# Altium project SINDiB_MM.PrjPcb (part 2 of 2)

## Sheet motor.SchDoc
size A4; SheetNumber: 4; SheetTotal: 4
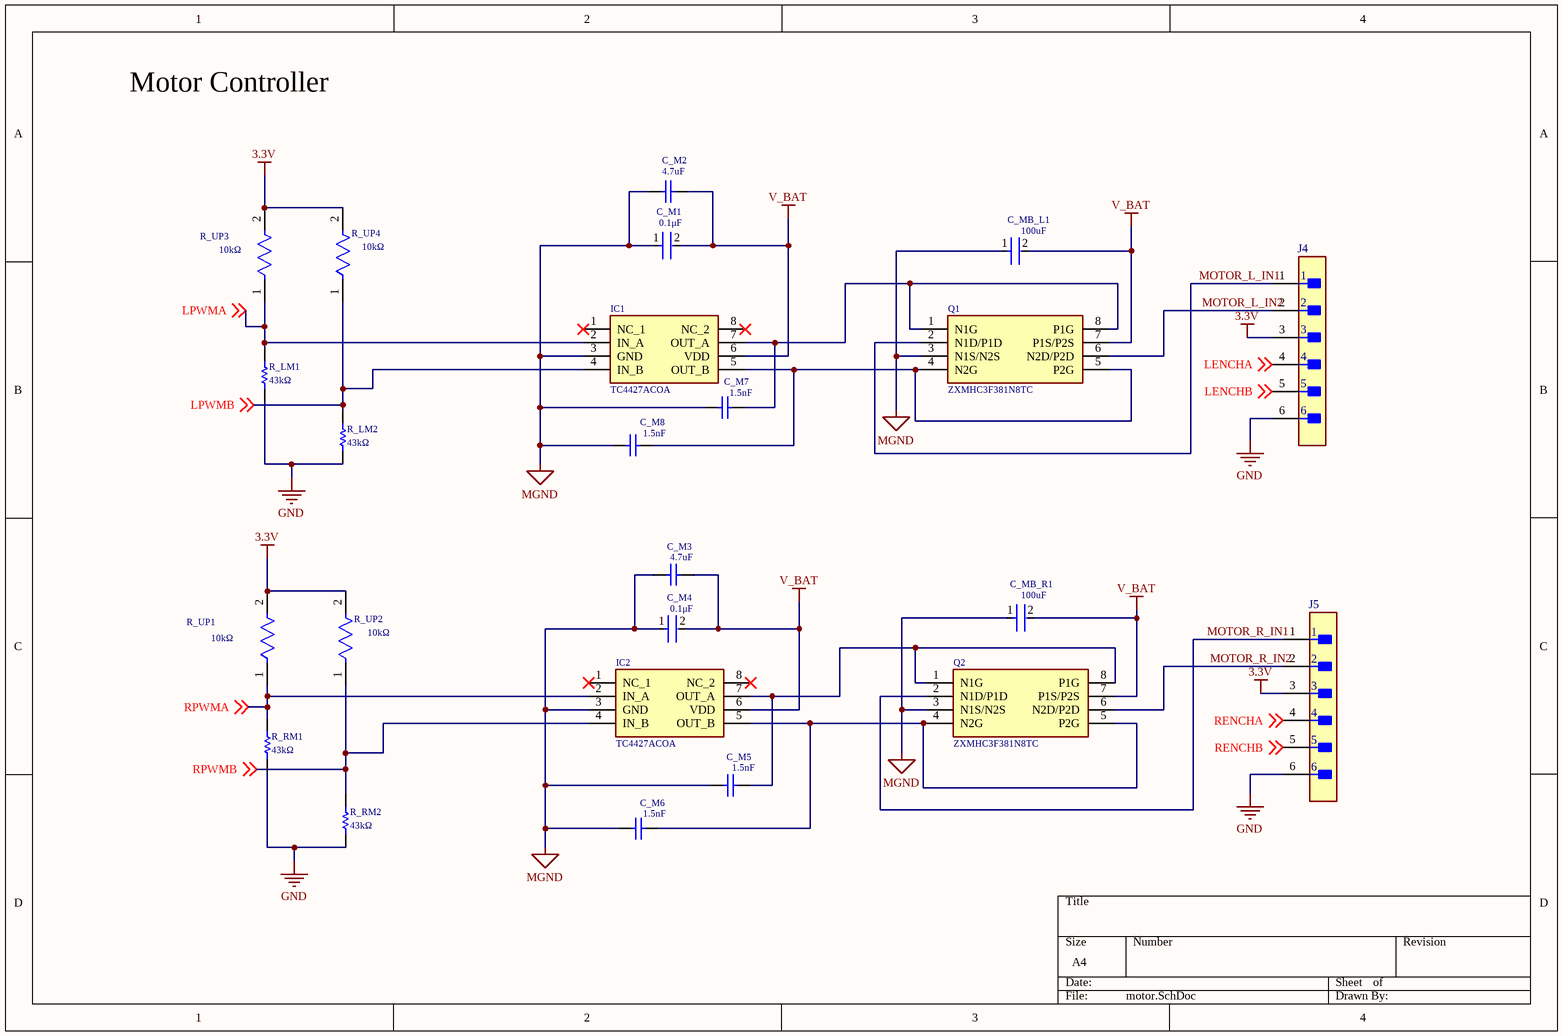
[diagram p3: motor.SchDoc]

### Parts
C_M1  value 0.1μF  [FP-C0805C-DN-MFG]  (hidden comment: C0805C104J8RACTU)
C_M2  value 4.7uF  [CAPC2013X145X50NL20T25]  (hidden comment: C0805C475M3PACTU)
C_M3  value 4.7uF  [CAPC2013X145X50NL20T25]  (hidden comment: C0805C475M3PACTU)
C_M4  value 0.1μF  [FP-C0805C-DN-MFG]  (hidden comment: C0805C104J8RACTU)
C_M5  Capacitance: 1.5nF  [CAPC2013X94X50ML20T25]  (hidden comment: 08051C152KAT2A)
C_M6  Capacitance: 1.5nF  [CAPC2013X94X50ML20T25]  (hidden comment: 08051C152KAT2A)
C_M7  Capacitance: 1.5nF  [CAPC2013X94X50ML20T25]  (hidden comment: 08051C152KAT2A)
C_M8  Capacitance: 1.5nF  [CAPC2013X94X50ML20T25]  (hidden comment: 08051C152KAT2A)
C_MB_L1  value 100uF  [FP-C1206C-EH-MFG]  (hidden comment: C1206C107M9PACTU)
C_MB_R1  value 100uF  [FP-C1206C-EH-MFG]  (hidden comment: C1206C107M9PACTU)
IC1  TC4427ACOA  [SOIC127P600X175-8N]
IC2  TC4427ACOA  [SOIC127P600X175-8N]
J4  22-28-4063  [FP-22-28-4063-MFG]  (value not drawn)
J5  22-28-4063  [FP-22-28-4063-MFG]  (value not drawn)
Q1  ZXMHC3F381N8TC  [SOIC127P600X175-8N]
Q2  ZXMHC3F381N8TC  [SOIC127P600X175-8N]
R_LM1  value 43kΩ  [RESC1608X55X30NL20T20]  (hidden comment: ERA3AEB433V)
R_LM2  value 43kΩ  [RESC1608X55X30NL20T20]  (hidden comment: ERA3AEB433V)
R_RM1  value 43kΩ  [RESC1608X55X30NL20T20]  (hidden comment: ERA3AEB433V)
R_RM2  value 43kΩ  [RESC1608X55X30NL20T20]  (hidden comment: ERA3AEB433V)
R_UP1  value 10kΩ  [FP-ERA3A-IPC_C]  (hidden comment: ERA-3AEB103V)
R_UP2  value 10kΩ  [FP-ERA3A-IPC_C]  (hidden comment: ERA-3AEB103V)
R_UP3  value 10kΩ  [FP-ERA3A-IPC_C]  (hidden comment: ERA-3AEB103V)
R_UP4  value 10kΩ  [FP-ERA3A-IPC_C]  (hidden comment: ERA-3AEB103V)

### Nets
3.3V: J4.3 J5.3 R_UP1.2 R_UP2.2 R_UP3.2 R_UP4.2
GND: J4.6 J5.6 R_LM1.1 R_LM2.1 R_RM1.1 R_RM2.1
MGND: C_M1.1 C_M2.2 C_M3.2 C_M4.1 C_M5.2 C_M6.2 C_M7.2 C_M8.2 C_MB_L1.1 C_MB_R1.1 IC1.3(GND) IC2.3(GND) Q1.3(N1S/N2S) Q2.3(N1S/N2S)
V_BAT: C_M1.2 C_M2.1 C_M3.1 C_M4.2 C_MB_L1.2 C_MB_R1.2 IC1.6(VDD) IC2.6(VDD) Q1.7(P1S/P2S) Q2.7(P1S/P2S)
LENCHA: J4.4 ; off-sheet LENCHA
LENCHB: J4.5 ; off-sheet LENCHB
LPWMA: IC1.2(IN_A) R_LM1.2 R_UP3.1 ; off-sheet LPWMA
LPWMB: IC1.4(IN_B) R_LM2.2 R_UP4.1 ; off-sheet LPWMB
MOTOR_L_IN1: J4.1 Q1.2(N1D/P1D)
MOTOR_L_IN2: J4.2 Q1.6(N2D/P2D)
MOTOR_R_IN1: J5.1 Q2.2(N1D/P1D)
MOTOR_R_IN2: J5.2 Q2.6(N2D/P2D)
RENCHA: J5.4 ; off-sheet RENCHA
RENCHB: J5.5 ; off-sheet RENCHB
RPWMA: IC2.2(IN_A) R_RM1.2 R_UP1.1 ; off-sheet RPWMA
RPWMB: IC2.4(IN_B) R_RM2.2 R_UP2.1 ; off-sheet RPWMB
NetC_M5_1: C_M5.1 IC2.7(OUT_A) Q2.1(N1G) Q2.8(P1G)
NetC_M6_1: C_M6.1 IC2.5(OUT_B) Q2.4(N2G) Q2.5(P2G)
NetC_M7_1: C_M7.1 IC1.7(OUT_A) Q1.1(N1G) Q1.8(P1G)
NetC_M8_1: C_M8.1 IC1.5(OUT_B) Q1.4(N2G) Q1.5(P2G)

Not connected (* = marked no-connect by the designer): IC1 1(NC_1)* 8(NC_2)*; IC2 1(NC_1)* 8(NC_2)*

### Notes on the sheet
- Motor Controller

### Library data of the parts
C_M1 C_M4 = CMP-03020-032188-1: CAP CER 0.1UF 10V 5% X7R 0805; Manufacturer: KEMET; Tolerance: 0.05; Capacitance: 0.10 μF; Temperature Coefficient: 30ppm/°C; Package: C0805C-DN; Device Class L1: Passive Components; Temperature: -55°C to +125°C; Category: Cap; RoHS: TRUE; Mouser Description: Multilayer Ceramic Capacitors MLCC - SMD/SMT 10volts 0.1uF X7R 5%; Lead Free: Yes; Temperature Range Low: -55°C; Material: Ceramic; Temperature Range High: +125°C; Device Class L2: Capacitors; Temperature Characteristic: X7R; Device Class L3: Ceramic Capacitors; ComponentLink2Description: Datasheet; Automotive: No; Ipc Land Pattern Name: CAPC200125X78; Manufacturer Part Number: C0805C104J8RACTU; Voltage Rating: 10 V; Height: 0.88mm; Digikey Description: CAP CER 0.1UF 10V 5% X7R 0805; Octopart: https://octopart.com/c0805c104j8ractu-kemet-11807087; ComponentLink2URL: https://content.kemet.com/datasheets/KEM_C1003_C0G_SMD.pdf
C_M2 C_M3 = CMP-2007-01014-1: Manufacturer: Kemet; Part Number: C0805C475M3PACTU; Capacitance: 4.7uF
C_M5-C_M8 = CMP-2007-04179-1: Manufacturer: AVX Interconnect / Elco; Value: 1.5nF; Part Number: 08051C152KAT2A
C_MB_L1 C_MB_R1 = CMP-1037-05005-3: CAP CER 100UF 6.3V X5R 1206; Dielectric Material: Ceramic; Tolerance: 2%; Dissipation Factor: 5%; Min Operating Temperature: -55°C; Case Code (Imperial): 1206; Case Code (Metric): 3216; Depth: 1.6mm; Dielectric: X5R; Max Operating Temperature: 85°C; Packaging: Tape and Reel; Construction: Flat; Series: C; Case/Package: 1206; Radiation Hardening: No; Voltage Rating (DC): 6.3V; Termination: SMD/SMT; Voltage Rating: 6.3V; Capacitance: 100uF; Number of Pins: 2; RoHS Compliant: Yes; Height: 1.6mm; Lead Free: Lead Free; Voltage: 6.3V; REACH SVHC: No SVHC; Length: 3.2mm; Mount: Surface Mount; Package Quantity: 1; Thickness: 0.071inch; Width: 0.063inch
IC1 IC2 = TC4427ACOA: Integrated Circuit; Manufacturer_Name: Microchip; Datasheet Link: https://datasheet.datasheetarchive.com/originals/distributors/Datasheets-306/110017.pdf; Height: 1.75mm; Manufacturer_Part_Number: TC4427ACOA; Mouser Part Number: 579-TC4427ACOA; Mouser Price/Stock: https://www.mouser.co.uk/ProductDetail/Microchip-Technology/TC4427ACOA?qs=g6BBfX6YTklnRUZ4V7kDWA%3D%3D; Arrow Part Number: TC4427ACOA; Arrow Price/Stock: https://www.arrow.com/en/products/tc4427acoa/microchip-technology?region=europe
J4 J5 = CMP-04776-000885-1: CONN HEADER VERT 6POS 2.54MM; Number of Circuits: 6; Voltage Rating (DC): 250V; Connector Type: Male Pin; Contact Resistance: 20mR; Glow Wire Compliant: Non-compliant; Gender: Male; Current Rating: 4A; Max Voltage Rating (DC): 250.25kV; Series: KK® 42375; Termination: Solder; Orientation: Straight; Max Operating Temperature: 75°C; Min Operating Temperature: 0°C; Mount: Through Hole; Depth: 2.49mm; Contact Material: Brass; Number of Positions: 6; Contact Mating Length: 0.24inch; Number of Rows: 1; Housing Color: Black; Max Voltage Rating (AC): 250V; Housing Material: Thermoplastic; Packaging: Bulk; Contact Plating: Gold; Contact Type: Male Pin; Package Quantity: 1; Number of Contacts: 6; Voltage Rating: 250V; Lead Free: Lead Free; RoHS Compliant: Yes; Pitch: 2.54mm; Color: Black; Flammability Rating: UL94 V-0; Radiation Hardening: No
Q1 Q2 = ZXMHC3F381N8TC: MOSFET (N-Channel); Manufacturer_Name: Diodes Inc.; Datasheet Link: https://www.diodes.com/assets/Datasheets/ZXMHC3F381N8.pdf; Height: 1.75mm; Manufacturer_Part_Number: ZXMHC3F381N8TC; Mouser Part Number: 522-ZXMHC3F381N8TC; Mouser Price/Stock: https://www.mouser.co.uk/ProductDetail/Diodes-Incorporated/ZXMHC3F381N8TC?qs=7E5rbXJDVJoJr15tcLBfrA%3D%3D; Arrow Part Number: ZXMHC3F381N8TC; Arrow Price/Stock: https://www.arrow.com/en/products/zxmhc3f381n8tc/diodes-incorporated?region=nac
R_LM1 R_LM2 R_RM1 R_RM2 = CMP-2000-00064-1: Manufacturer: Panasonic; Part Number: ERA3AEB433V; Resistance: 43kΩ
R_UP1-R_UP4 = CMP-2000-00874-2: RES SMD 10K OHM 0.1% 1/10W 0603; Voltage Rating (DC): 75V; Power Rating: 100mW; Resistance: 10kR; Temperature Coefficient: 25ppm/°C; Radiation Hardening: No; Width: 0.8mm; Depth: 0.8mm; Construction: Rectangular; Case Code (Metric): 1608; Package Quantity: 5000; Length: 1.6mm; Size Code: 0603; Case Code (Imperial): 0603; Termination: SMD/SMT; Contact Plating: Tin; Resistance Tolerance: 0.1%; Military Standard: Not; Packaging: Tape and Reel; Max Power Dissipation: 100mW; REACH SVHC: No SVHC; Series: ERA-3A; Voltage Rating: 75V; Lead Free: Lead Free; Technology: METAL FILM; RoHS Compliant: Yes; Max Operating Temperature: 155°C; Resistor Type: Thin Film; Min Operating Temperature: -55°C; Number of Pins: 2; Case/Package: 0603; Tolerance: 0.1%; Height: 0.45mm; Mount: Surface Mount; Number of Terminations: 2

## Nets that join several sheets
3.3V: power (5 pins), sensors (L_BEAD2.2), main_controller (14 pins), motor (6 pins)
3.3V_RE: power (L1.2), sensors (10 pins)
5V: power (13 pins), sensors (10 pins), main_controller (J7.4)
A3.3V: power (L2.2), sensors (6 pins), main_controller (C_VA1.1 C_VA2.2 U4.13)
AGND: power (NT2.2), sensors (10 pins), main_controller (C_VA1.2 C_VA2.1 U4.12)
AGND2: power (NT3.2), sensors (7 pins)
GND: power (37 pins), sensors (16 pins), main_controller (19 pins), motor (6 pins)
MGND: power (C_MP1.2 NT1.1), motor (14 pins)
V_BAT: power (7 pins), motor (10 pins)
BUZZER: sensors (Q_ES4.1 R_BZ.2), main_controller (U4.16)
CE: power (P1.7), main_controller (U4.37)
CLK: power (P1.3), main_controller (U4.34)
CS: sensors (IC3.5), main_controller (U4.39)
D_C: power (P1.6), main_controller (U4.10)
DATA_IN: power (P1.4), main_controller (U4.36)
DIAGONAL_EMITTER: sensors (Q_ES2.1 R_EMPD2.2), main_controller (U4.25)
DRDY: sensors (IC3.6), main_controller (U4.17)
INT: sensors (IC3.7), main_controller (U4.29)
L_RECEIVER: sensors (Q_RS2.1 Q_RS5.1 R_L_R.2), main_controller (U4.26)
LED1: power (RL1.2), main_controller (U4.44)
LED2: power (RL2.2), main_controller (U4.45)
LED3: power (RL3.2), main_controller (U4.51)
LED4: power (RL4.2), main_controller (U4.52)
LED5: power (RL5.2), main_controller (U4.53)
LED6: power (RL6.2), main_controller (U4.54)
LED7: power (R_LED7.2), main_controller (U4.41)
LED8: power (RL8.2), main_controller (U4.56)
LED9: power (RL9.2), main_controller (U4.33)
LED10: power (RL10.2), main_controller (U4.8)
LED11: power (RL11.2), main_controller (U4.30)
LENCHA: main_controller (U4.50), motor (J4.4)
LENCHB: main_controller (U4.55), motor (J4.5)
LF_EMITTER: sensors (Q_ES3.1 R_EMPD3.2), main_controller (U4.38)
LF_RECEIVER: sensors (Q_RS1.1 R_LFr.2), main_controller (U4.27)
LPWMA: main_controller (U4.58), motor (IC1.2 R_LM1.2 R_UP3.1)
LPWMB: main_controller (U4.59), motor (IC1.4 R_LM2.2 R_UP4.1)
R_RECEIVER: sensors (Q_RS3.1 Q_RS6.1 R_R_R.2), main_controller (U4.24)
RENCHA: main_controller (U4.14), motor (J5.4)
RENCHB: main_controller (U4.15), motor (J5.5)
RESET: power (P1.5), main_controller (6 pins)
RF_EMITTER: sensors (Q_ES1.1 R_EMPD1.2), main_controller (U4.9)
RF_RECEIVER: sensors (Q_RS4.1 R_RFr.2), main_controller (U4.20)
RPWMA: main_controller (U4.61), motor (IC2.2 R_RM1.2 R_UP1.1)
RPWMB: main_controller (U4.62), motor (IC2.4 R_RM2.2 R_UP2.1)
SCK: sensors (IC3.2), main_controller (U4.21)
SDI: sensors (IC3.3), main_controller (U4.23)
SDO: sensors (IC3.4), main_controller (U4.22)
TB1: power (R_BT1.2 SW_1.2), main_controller (U4.2)
VOL_METER: power (R_VM1.1 R_VM2.2), main_controller (U4.11)